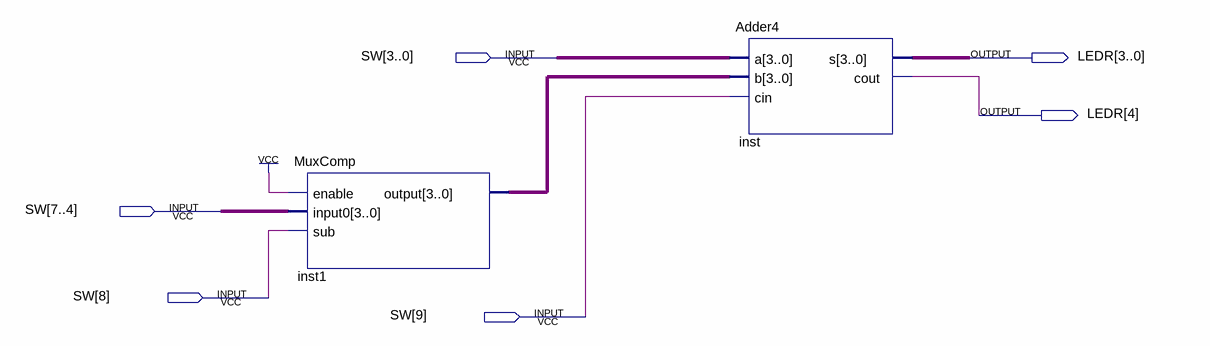
[diagram p0: schematic sheet]
// Quartus schematic CenasDemo.bdf as structural Verilog: 2 symbols, 6 pins
module CenasDemo (
  input  [9:0] SW,
  output [4:0] LEDR
);

  wire [3:0] inst1_output;

  MuxComp inst1 (.enable(1'b1), .input0(SW[7:4]), .sub(SW[8]), .\output (inst1_output));
  Adder4 inst (.a(SW[3:0]), .b(inst1_output), .cin(SW[9]), .s(LEDR[3:0]), .cout(LEDR[4]));
endmodule
